# EAGLE design mosquino-power-lipol (EAGLE 5.06)
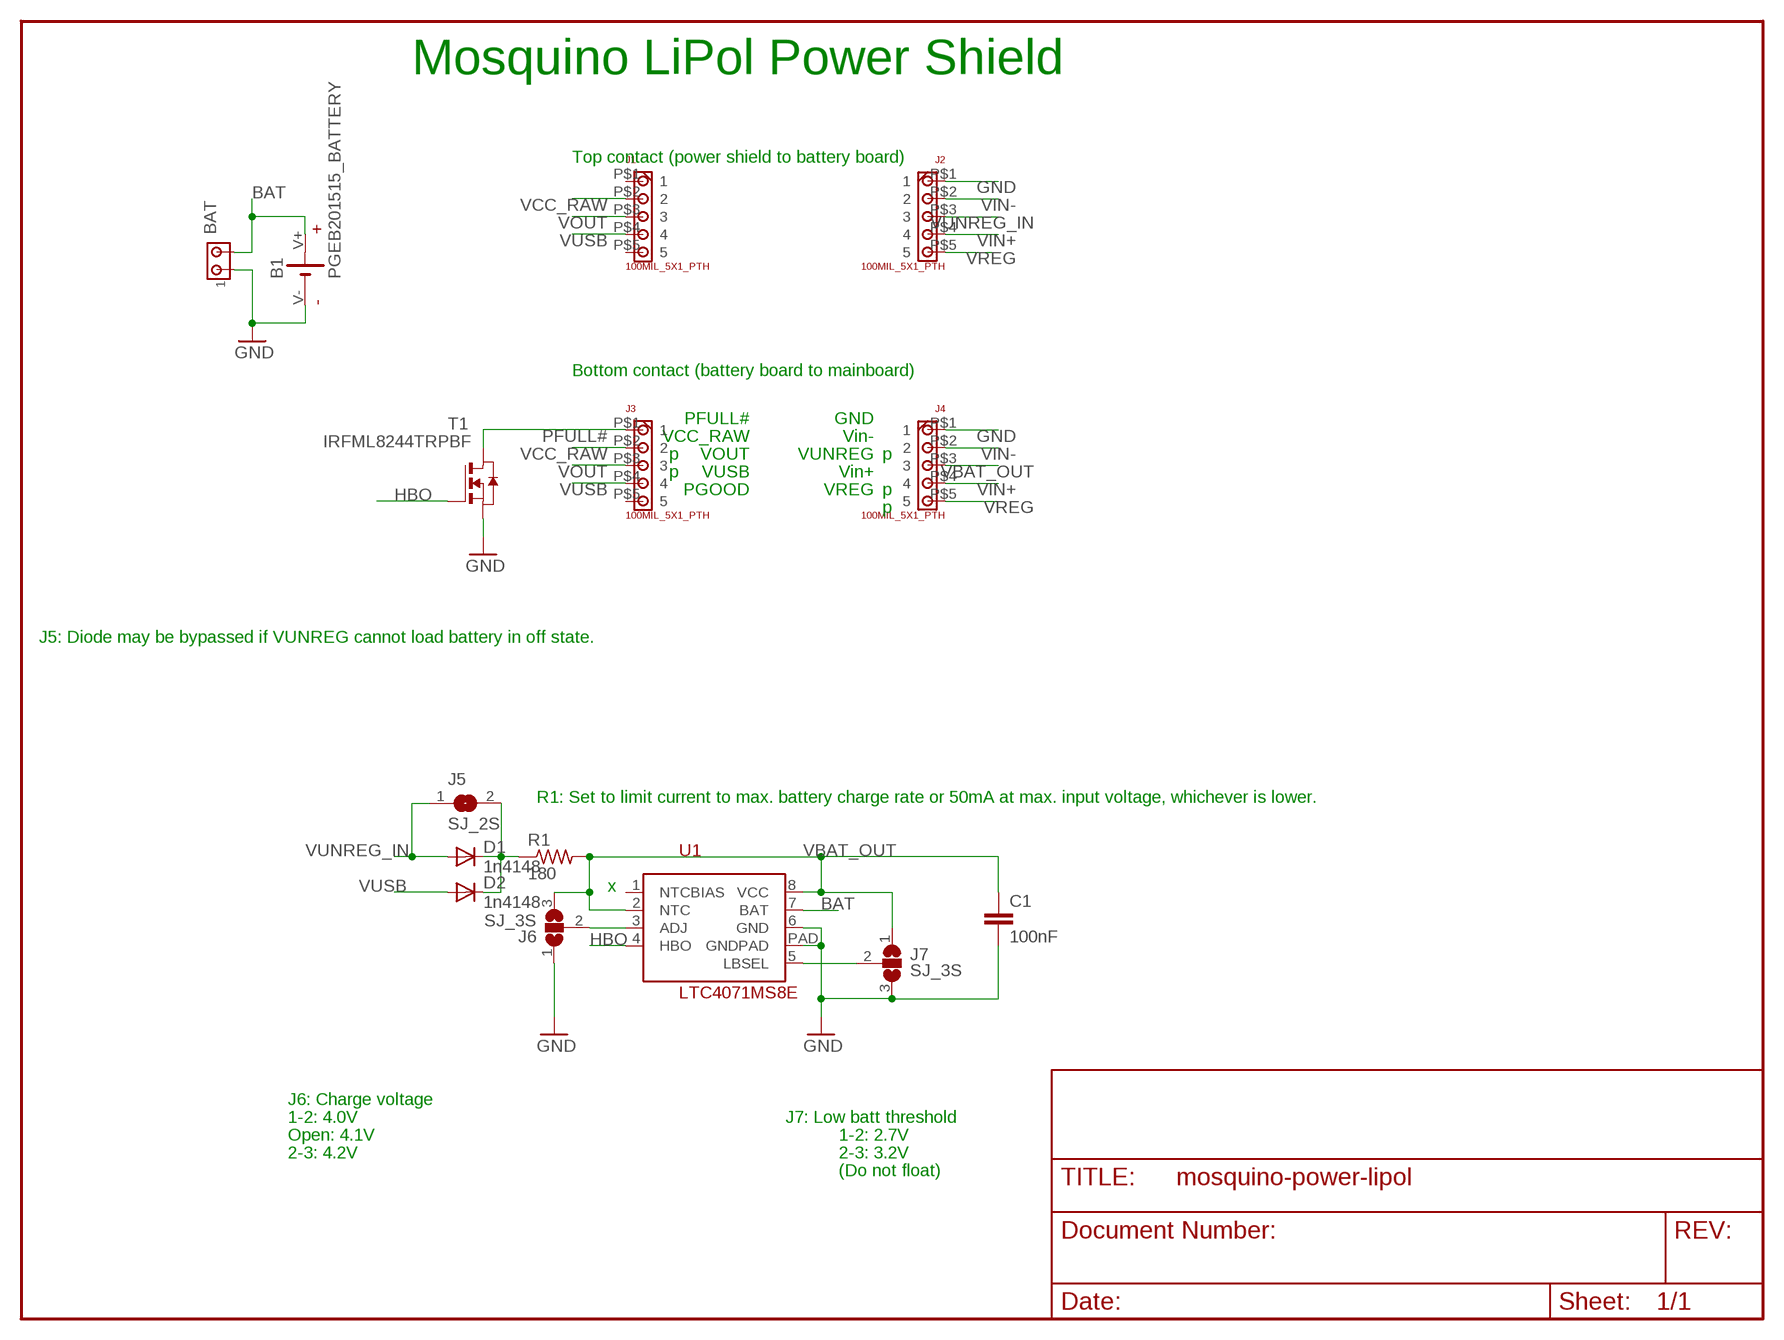
[diagram p0: schematic, sheet 1]

## Parts
B1  PGEB201515_BATTERY  [PGEB201515_LIPOL_BATTERY]
BAT  MTA02-100  [10X02MTA]
C1  100nF  C-EUC0805  [C0805]
D1  1n4148  CGRM4001-G  [SOD-123_MINI-SMA]
D2  1n4148  CGRM4001-G  [SOD-123_MINI-SMA]
J1  100MIL_5X1_PTH  [100MIL_DIP_5X1]
J2  100MIL_5X1_PTH  [100MIL_DIP_5X1]
J3  100MIL_5X1_PTH  [100MIL_DIP_5X1]
J4  100MIL_5X1_PTH  [100MIL_DIP_5X1]
J5  SJ_2S  [SJ2_S]
J6  SJ_3S  [SJ3_S]
J7  SJ_3S  [SJ3_S]
R1  180  R-US_R0805  [R0805]
T1  IRFML8244TRPBF  NMOSSOT23  [SOT-23]
U1  LTC4071MS8E  [MSOP8-PAD-HAND]

## Nets
BAT: B1.V+(+) BAT.2 U1.7(BAT)
GND [pwr]: B1.V-(-) BAT.1 C1.2 J2.P$1 J4.P$1 J6.1 J7.3 T1.2(S) U1.6(GND) U1.PAD(GNDPAD)
HBO: T1.3(G) U1.4(HBO)
N$2: J7.2 U1.5(LBSEL)
N$3: D1.C D2.C J5.2 R1.1
N$4: J6.2 U1.3(ADJ)
PFULL#: J3.P$1 T1.1(D)
VBAT_OUT: C1.1 J4.P$3 J6.3 J7.1 R1.2 U1.2(NTC) U1.8(VCC)
VCC_RAW: J1.P$2 J3.P$2
VIN+ [pwr]: J2.P$4 J4.P$4
VIN- [pwr]: J2.P$2 J4.P$2
VOUT: J1.P$3 J3.P$3
VREG [pwr]: J2.P$5 J4.P$5
VUNREG_IN: D1.A J2.P$3 J5.1
VUSB: D2.A J1.P$4 J3.P$4
Unconnected: J1.P$1 J1.P$5 J3.P$5 U1.1(NTCBIAS)

## Notes on the sheet
- Mosquino LiPol Power Shield
- Top contact (power shield to battery board)
- Bottom contact (battery board to mainboard)
- PFULL# | GND
- VCC_RAW | Vin-
- p | VOUT | VUNREG | p
- p | VUSB | Vin+
- PGOOD | VREG | p
- p
- J5: Diode may be bypassed if VUNREG cannot load battery in off state.
- R1: Set to limit current to max. battery charge rate or 50mA at max. input voltage, whichever is lower.
- x
- J6: Charge voltage
- 1-2: 4.0V | J7: Low batt threshold
- Open: 4.1V | 1-2: 2.7V
- 2-3: 4.2V | 2-3: 3.2V
- (Do not float)

## Library data of the parts
B1 = mideeval:PGEB201515_BATTERY: Powerstream ultrathin 10mAh Li-Pol packet battery. 20100107 / tgipson
BAT = con-amp:MTA02-100: AMP connector
C1 = rcl:C-EU: CAPACITOR, European symbol
D1 D2 = diode:CGRM400*-G: Molded plasitc,JEDEC SOD-123/Mini SMA Source: Comchip CGRM4001-G.pdf
J1-J4 = tim:100MIL_5X1_PTH
J5 = mideeval:SJ_2S: Small solder jumper, 2 pin. 20060130 / tgipson
J6 J7 = mideeval:SJ_3S: Small solder jumper, 3 pin. 20060130 / tgipson
R1 = rcl:R-US_: RESISTOR, American symbol
T1 = zetex:NMOSSOT23: MOS FET
U1 = tim:LTC4071

## Net classes
0 default: width 0.203 mm
1 pwr: width 0.203 mm, drill 0.381 mm, clearance 0.203 mm
4 digital: width 0.203 mm, drill 0.381 mm, clearance 0.203 mm

## Board
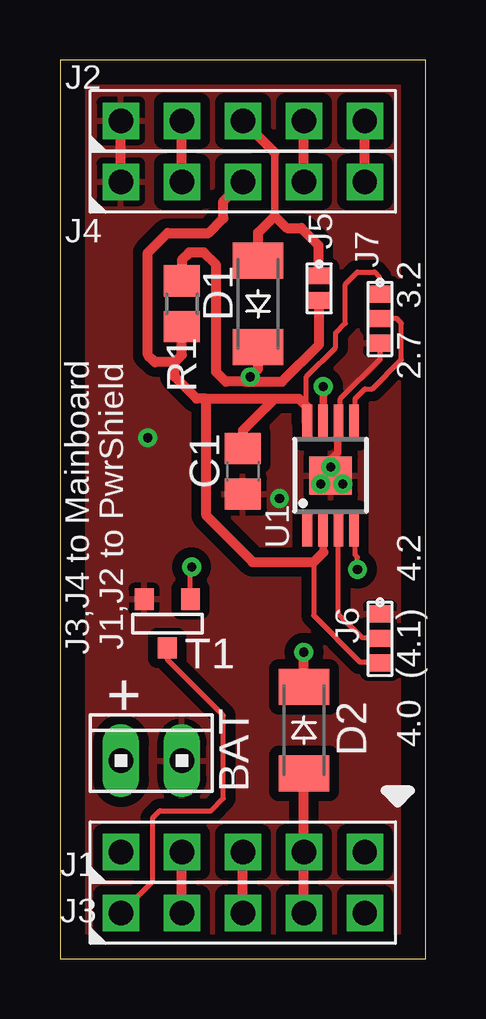
[diagram p1: board, top side]
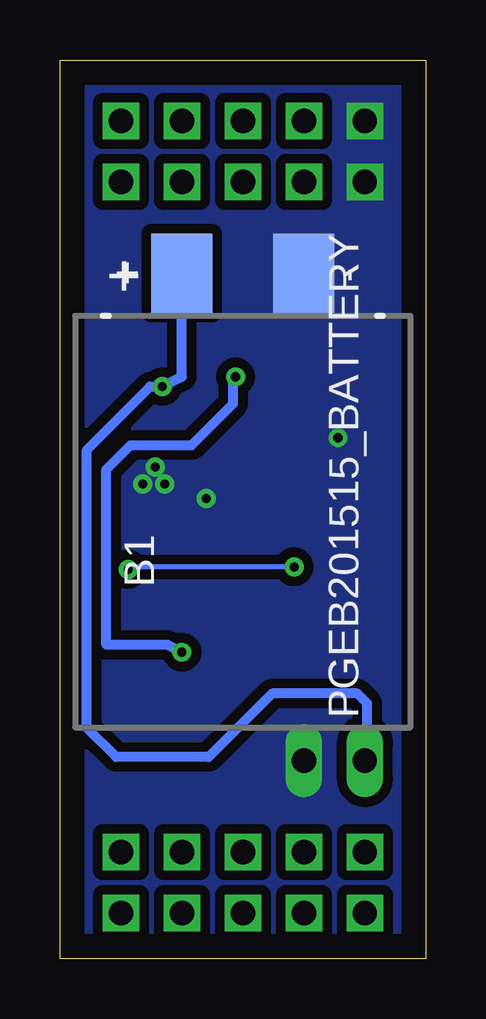
[diagram p2: board, bottom side, seen from below]

Size 15.24 x 37.47 mm. Coordinates in mm from the lower left corner, seen from the top.
Outline: 0,0 15.24,0 15.24,37.47 0,37.47 0,0
Copper layers (1*16): Top 0.035mm / dielectric 1.5mm / Bottom 0.035mm
Design rules "default": minimum track width 8mil, minimum drill 15mil, track to track 8mil, track to pad 8mil, pad to pad 8mil, via to via 8mil, smd to smd 8mil, copper to edge 40mil, drill to drill 8mil, minimum pad ring 10mil, minimum via ring 8mil, stop-mask expansion 4mil, vias tented up to drill 0mil, thermal gap 10mil

### Footprints (pad centres in the part's own frame; a part is rotated, then mirrored left to right if it is on the bottom)
PGEB201515_LIPOL_BATTERY = smd 3.302 x 2.54: V+ 0,2.54; V- 0,-2.54
10X02MTA = drill 1.016 long: 1 1.27,0; 2 -1.27,0
C0805 = smd 1.3 x 1.5: 1 -0.95,0; 2 0.95,0
SOD-123_MINI-SMA = smd 1.5 x 2.1: A 1.8,0; C -1.8,0
100MIL_DIP_5X1 = drill 1.016 square: P$1 -5.08,0; P$2 -2.54,0; P$3 0,0; P$4 2.54,0; P$5 5.08,0
SJ2_S = smd 0.7 x 0.9: 1 -0.523,0; 2 0.493,0
SJ3_S = smd 0.7 x 0.9: 1 -1.031,0; 2 -0.015,0; 3 1.001,0
R0805 = smd 1.3 x 1.5: 1 -0.95,0; 2 0.95,0
SOT-23 = smd 0.787 x 0.889: 1 0.025,-1.016; 2 -0.94,1.016; 3 0.991,1.016
MSOP8-PAD-HAND = smd 0.4 x 1.524: 1 -0.975,-2.202; 2 -0.325,-2.202; 3 0.325,-2.202; 4 0.975,-2.202; 5 0.975,2.202; 6 0.325,2.202; 7 -0.325,2.202; 8 -0.975,2.202 | smd 1.778 x 1.575: PAD 0,0

### Placement (x,y rotation side)
B1  7.62,28.58 90 bottom
BAT  3.81,8.25 0 top
C1  7.62,20.32 270 top
D1  8.26,27.3 90 top
D2  10.16,9.53 270 top
J1  7.62,4.45 0 top
J2  7.62,34.93 0 top
J3  7.62,1.91 0 top
J4  7.62,32.38 0 top
J5  10.79,27.94 270 top
J6  13.34,13.33 270 top
J7  13.34,26.67 270 top
R1  5.08,27.3 270 top
T1  4.45,13.97 0 top
U1  11.28,20.14 0 top

### Tracks (layer width: path | path; a pad name or v marks a point on that pad's centre or on a via)
BAT  (via drill 0.38)
  Top 0.305: U1.7 10.97,22.37 v10.97,23.85
  Bottom 0.406: B1.V+ 10.16,24.26 v10.97,23.85 11.48,23.85 14.12,21.21 14.12,9.63 12.9,8.41 9.04,8.41 6.4,11.05 2.85,11.05 2.44,10.64 2.44,8.36 BAT.2
GND  (via drill 0.38)
  Top 0.203: J7.3 13.34,24.99 11.68,23.34 11.68,22.37 U1.6
  Top 0.305: U1.6 11.58,22.32 11.58,21.11 11.28,20.8 v11.28,20.5 U1.PAD
  Top 0.406: J4.P$1 J2.P$1
  other vias: 9.14,19.18 3.66,21.72 10.87,19.79 11.79,19.79
  pour Top (isolate 0.406): 0,0 0,37.47 15.24,37.47 15.24,0
  pour Bottom (isolate 0.406, no thermals): 15.24,0 15.24,37.47 0,37.47 0,0
HBO  (via drill 0.38)
  Top 0.203: U1.4 12.29,17.9 12.29,16.84 12.39,16.74 v12.39,16.23 | v5.49,16.33 5.44,16.28 T1.3
  Bottom 0.203: v12.39,16.23 12.29,16.33 v5.49,16.33
N$2
  Top 0.203: J7.2 14.03,26.69 14.22,26.49 14.22,24.97 13.01,23.75 12.7,23.75 12.29,23.34 12.29,22.39 U1.5
N$3  (via drill 0.38)
  Top 0.406: D1.C 8.26,24.59 v7.92,24.26 7.77,24.11 | 7.77,24.11 7.72,24.05 6.91,24.05 6.5,24.46 6.5,28.93 5.99,29.44 5.38,29.44 5.08,29.13 R1.1 | J5.2 10.79,25.6 9.25,24.05 7.82,24.05 7.77,24.11 | D2.C v10.16,12.78
  Bottom 0.406: v10.16,12.78 10.77,13.08 13.31,13.08 13.31,20.4 12.29,21.41 9.75,21.41 8.03,23.14 8.03,24.16 v7.92,24.26
N$4
  Top 0.203: J6.2 13.3,13.39 12.6,13.39 11.6,14.38 U1.3
PFULL#
  Top 0.203: J3.P$1 3.86,3.23 3.86,5.87 4.17,6.17 6.3,6.17 6.81,6.68 6.81,10.13 4.47,12.47 T1.1
VBAT_OUT
  Top 0.203: J7.1 13.31,27.73 13.31,28.42 13.11,28.63 12.39,28.63 11.89,28.12 11.89,26.49 11.48,26.09 11.48,25.48 10.26,24.26 10.26,23.04 | J6.3 13.3,12.37 12.5,12.37 10.57,14.3 10.57,16.54
  Top 0.305: U1.2 10.97,17.92 10.97,16.94
  Top 0.406: R1.2 5.08,25.17 4.78,24.87 | 4.78,24.87 3.96,24.87 3.66,25.17 3.66,29.44 4.47,30.25 6.2,30.25 6.81,30.86 6.81,31.57 J4.P$3 | U1.8 10.26,22.39 10.26,23.04 9.96,23.34 8.94,23.34 | 6.1,23.34 5.69,23.34 4.78,24.26 4.78,24.87 | 6.1,23.34 8.94,23.34 | C1.1 7.62,22.02 8.94,23.34 | 10.97,16.94 10.57,16.54 8.03,16.54 6.1,18.47 6.1,23.34
VCC_RAW
  Top 0.406: J3.P$2 J1.P$2
VIN+
  Top 0.406: J4.P$4 J2.P$4
VIN-
  Top 0.406: J4.P$2 J2.P$2
VOUT
  Top 0.406: J3.P$3 J1.P$3
VREG
  Top 0.406: J4.P$5 J2.P$5
VUNREG_IN
  Top 0.305: 8.94,30.96 8.94,33.6
  Top 0.406: J5.1 10.77,28.46 10.77,29.74 10.06,30.46 9.45,30.46 8.94,30.96 8.26,30.28 D1.A | 8.94,33.6 J2.P$3
VUSB
  Top 0.406: J3.P$4 J1.P$4 D2.A

### Text on the board
tPlace: 3.2 | 2.7 | 4.2 | J3,J4 to Mainboard | J1,J2 to PwrShield | (4.1) | + | 4.0
bPlace: +